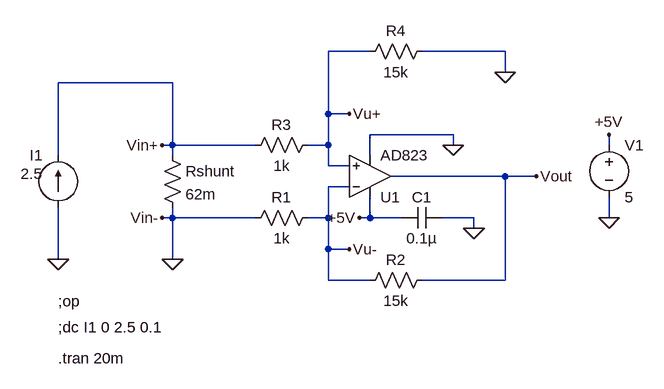
[diagram p0: schematic current-measurement-of-a-collector-motor.asc]
current-measurement-of-a-collector-motor.asc, the LTspice schematic file:
Version 4
SHEET 1 952 680
WIRE 528 -64 464 -64
WIRE 736 -64 608 -64
WIRE 736 -32 736 -64
WIRE 224 -16 48 -16
WIRE 464 32 464 -64
WIRE 496 32 464 32
WIRE 656 64 528 64
WIRE 224 80 224 -16
WIRE 224 80 208 80
WIRE 352 80 224 80
WIRE 464 80 464 32
WIRE 464 80 432 80
WIRE 656 80 656 64
WIRE 896 80 896 64
WIRE 48 96 48 -16
WIRE 224 96 224 80
WIRE 528 96 528 64
WIRE 464 112 464 80
WIRE 496 112 464 112
WIRE 736 128 560 128
WIRE 784 128 736 128
WIRE 496 144 464 144
WIRE 224 192 224 176
WIRE 224 192 208 192
WIRE 352 192 224 192
WIRE 464 192 464 144
WIRE 464 192 432 192
WIRE 528 192 528 160
WIRE 528 192 512 192
WIRE 576 192 528 192
WIRE 688 192 640 192
WIRE 896 192 896 160
WIRE 688 208 688 192
WIRE 464 240 464 192
WIRE 496 240 464 240
WIRE 48 256 48 176
WIRE 224 256 224 192
WIRE 464 288 464 240
WIRE 528 288 464 288
WIRE 736 288 736 128
WIRE 736 288 608 288
FLAG 48 256 0
FLAG 224 256 0
FLAG 208 80 Vin+
FLAG 208 192 Vin-
FLAG 896 64 +5V
FLAG 896 192 0
FLAG 688 208 0
FLAG 736 -32 0
FLAG 784 128 Vout
FLAG 496 32 Vu+
FLAG 496 240 Vu-
FLAG 656 80 0
FLAG 512 192 +5V
SYMBOL res 208 80 R0
SYMATTR InstName Rshunt
SYMATTR Value 62m
SYMBOL OpAmps\\AD823 528 192 M180
SYMATTR InstName U1
SYMBOL voltage 896 64 R0
WINDOW 123 0 0 Left 0
WINDOW 39 0 0 Left 0
SYMATTR InstName V1
SYMATTR Value 5
SYMBOL res 448 176 R90
WINDOW 0 0 56 VBottom 2
WINDOW 3 32 56 VTop 2
SYMATTR InstName R1
SYMATTR Value 1k
SYMBOL res 624 272 R90
WINDOW 0 0 56 VBottom 2
WINDOW 3 32 56 VTop 2
SYMATTR InstName R2
SYMATTR Value 15k
SYMBOL res 448 64 R90
WINDOW 0 0 56 VBottom 2
WINDOW 3 32 56 VTop 2
SYMATTR InstName R3
SYMATTR Value 1k
SYMBOL res 624 -80 R90
WINDOW 0 0 56 VBottom 2
WINDOW 3 32 56 VTop 2
SYMATTR InstName R4
SYMATTR Value 15k
SYMBOL cap 640 176 R90
WINDOW 0 0 32 VBottom 2
WINDOW 3 32 32 VTop 2
SYMATTR InstName C1
SYMATTR Value 0.1µ
SYMBOL current 48 176 R180
WINDOW 0 24 80 Left 2
WINDOW 3 24 52 Left 2
WINDOW 123 0 0 Left 0
WINDOW 39 0 0 Left 0
SYMATTR InstName I1
SYMATTR Value 2.5
TEXT 48 320 Left 2 !;op
TEXT 48 360 Left 2 !;dc I1 0 2.5 0.1
TEXT 48 408 Left 2 !.tran 20m

The netlist it stands for:
* current-measurement-of-a-collector-motor.asc
Rshunt Vin+ 0 62m
XU1 Vu+ Vu- +5V 0 Vout AD823  ; pins In+ In- V+ V- OUT
V1 +5V 0 5
R1 Vu- 0 1k
R2 Vout Vu- 15k
R3 Vu+ Vin+ 1k
R4 0 Vu+ 15k
C1 0 +5V 0.1µ
I1 0 Vin+ 2.5
;op
;dc I1 0 2.5 0.1
.tran 20m
.lib ADI.lib
.backanno
.end